# Altium schematic sheet Pico.SchDoc
size A; SheetNumber: 3; SheetTotal: 5
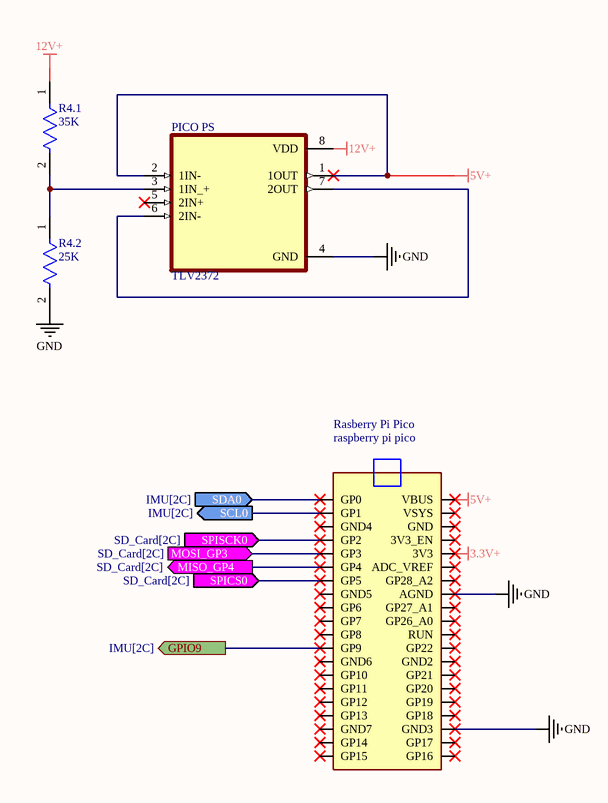
[diagram p0: Pico.SchDoc]

## Parts
PICO_PS  TLV2372  [DIP794W45P254L959H508Q8]
R4.1  35K  [FP-MFR-12-MFG]
R4.2  25K  [FP-MFR-12-MFG]
Rasberry_Pi_Pico  (no value)  [RASPBERRY_PI_PICO]

## Ports
GPIO9 (out, see IMU[2C]), MISO_GP4 (out, see SD_Card[2C]), MOSI_GP3 (in, see SD_Card[2C]), SCL0 (out, see IMU[2C]), SDA0 (in, see IMU[2C]), SPICS0 (in, see SD_Card[2C]), SPISCK0 (in, see SD_Card[2C])

## Nets
3.3V+: Rasberry_Pi_Pico.3V3
5V+: PICO_PS.1(1OUT) PICO_PS.2(1IN-) Rasberry_Pi_Pico.VBUS
12V+: PICO_PS.8(VDD) R4.1.1
GND: PICO_PS.4(GND) R4.2.2 Rasberry_Pi_Pico.AGND Rasberry_Pi_Pico.GND3
GPIO9: Rasberry_Pi_Pico.GP9 ; port GPIO9
MISO_GP4: Rasberry_Pi_Pico.GP4 ; port MISO_GP4
MOSI_GP3: Rasberry_Pi_Pico.GP3 ; port MOSI_GP3
SCL0: Rasberry_Pi_Pico.GP1 ; port SCL0
SDA0: Rasberry_Pi_Pico.GP0 ; port SDA0
SPICS0: Rasberry_Pi_Pico.GP5 ; port SPICS0
SPISCK0: Rasberry_Pi_Pico.GP2 ; port SPISCK0
NetPICO_PS_3: PICO_PS.3(1IN_+) R4.1.2 R4.2.1
NetPICO_PS_6: PICO_PS.6(2IN-) PICO_PS.7(2OUT)

Not connected (* = marked no-connect by the designer): PICO_PS 5(2IN+)*; Rasberry_Pi_Pico 3V3_EN* ADC_VREF* GND* GND2* GND4* GND5* GND6* GND7* GP6* GP7* GP8* GP10* GP11* GP12* GP13* GP14* GP15* GP16* GP17* GP18* GP19* GP20* GP21* GP22* GP26_A0* GP27_A1* GP28_A2* RUN* VSYS*

## Notes on the sheet
- (in symbol RASPBERRY_PI_PICO) raspberry pi pico

## Library data of the parts
PICO_PS = TLV2372IP: Dual, 16-V, 3-MHz, RRIO operational amplifier; MF: Texas Instruments; SnapEDA_Link: https://www.snapeda.com/parts/TLV2372IP/Texas+Instruments/view-part/?ref=snap; Package: PDIP-8 Texas; Value: *; MP: TLV2372IP; Check_prices: https://www.snapeda.com/parts/TLV2372IP/Texas+Instruments/view-part/?ref=eda
R4.1 R4.2 = CMP-03413-000012-1: RES MF 1/6W 1% AXIAL; Power Rating: 160mW; Voltage Rating (DC): 200V; Resistance: 10kR; Min Operating Temperature: -55°C; Max Operating Temperature: 155°C; Voltage Rating: 200V; Termination: Axial; Packaging: Ammo Pack; Tolerance: 1%
Rasberry_Pi_Pico = RASPBERRY_PI_PICO: Raspberry Pi Board, Arm Cortex-M0+; Core Architecture:Arm; Core Sub-Architecture:Cortex-M0+; Kit Contents:Raspberry Pi Pico Board; No. Of Bits:32Bit; Silicon Core Number:Rp2040; Silicon Manufacturer:Raspberry Pi |Raspberry-Pi RASPBERRY PI PICO; SnapEDA_Link: https://www.snapeda.com/parts/RASPBERRY%20PI%20PICO/Raspberry+Pi/view-part/?ref=snap; Package: None; Value: *; MF: Raspberry Pi; MP: RASPBERRY PI PICO; Check_prices: https://www.snapeda.com/parts/RASPBERRY%20PI%20PICO/Raspberry+Pi/view-part/?ref=eda